# Altium project 6P1 Proto Board.PrjPcb
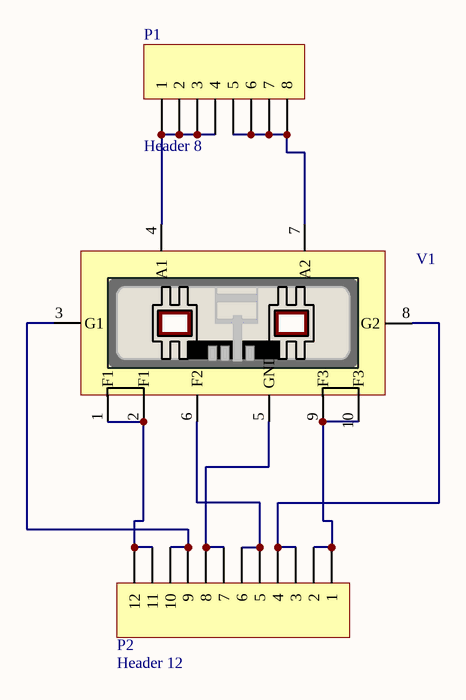
[diagram p0: 6P1.SchDoc]
1 sheet, 3 parts. Net scope: global (net labels, ports and power ports of the same name join across sheets).
Board file: 6P1.PcbDoc

## Sheet 6P1.SchDoc
size A4

### Parts
P1  Header 8  [HDR1X8]
P2  Header 12  [HDR1X12]
V1  Nutube 6P1  [Nutube 6P1]  (value not drawn)

### Nets
NetP1_1: P1.1 P1.2 P1.3 P1.4 V1.4(A1)
NetP1_5: P1.5 P1.6 P1.7 P1.8 V1.7(A2)
NetP2_1: P2.1 P2.2 V1.9(F3) V1.10(F3)
NetP2_3: P2.3 P2.4 V1.8(G2)
NetP2_5: P2.5 P2.6 V1.6(F2)
NetP2_7: P2.7 P2.8 V1.5(GND)
NetP2_9: P2.9 P2.10 V1.3(G1)
NetP2_11: P2.11 P2.12 V1.1(F1) V1.2(F1)

### Notes on the sheet
- Class Information:
- Title:
- Size:
- Date:
- A4
- Author:
- Time:
- Revision:
- Sheet:
- of
- File:

### Library data of the parts
P1 = Header 8: Header, 8-Pin; LatestRevisionDate: 17-Jul-2002; LatestRevisionNote: Re-released for DXP Platform.; Publisher: Altium Limited
P2 = Header 12: Header, 12-Pin; LatestRevisionDate: 17-Jul-2002; LatestRevisionNote: Re-released for DXP Platform.; Publisher: Altium Limited